# Altium schematic sheet RFE_Cellularv2.SchDoc
size A4
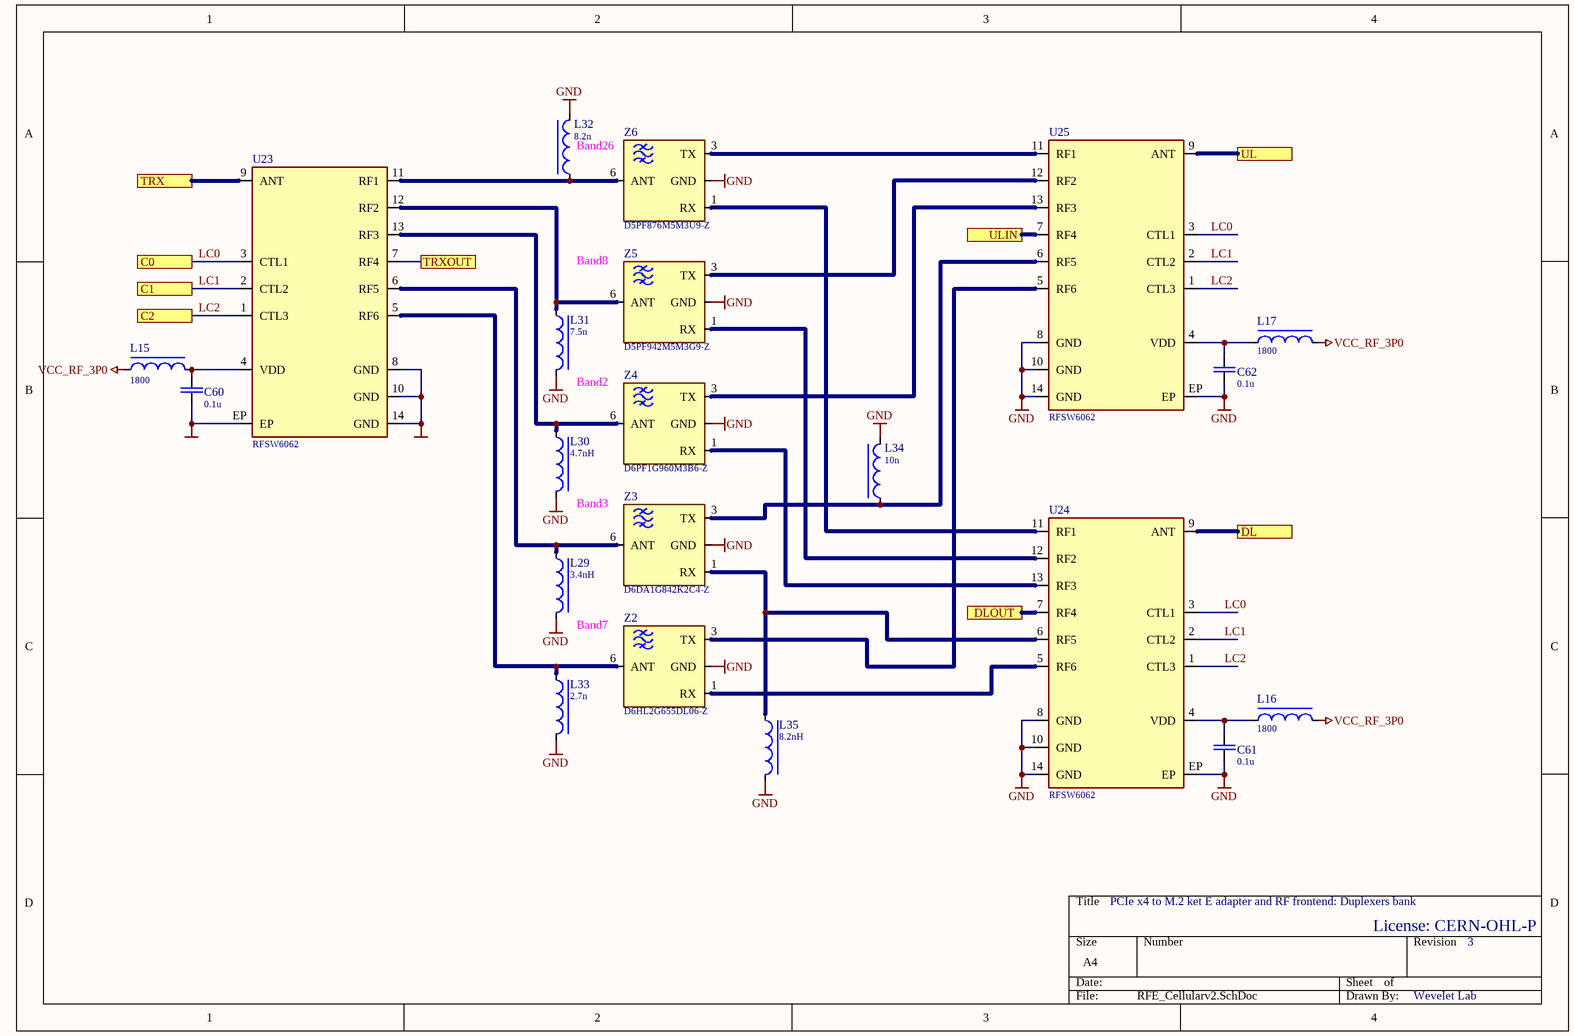
[diagram p0: RFE_Cellularv2.SchDoc]

## Parts
C60  value 0.1u  [CAPC100X50X55L25N]  (hidden comment: GRM155R71E104KE14D)
C61  value 0.1u  [CAPC100X50X55L25N]  (hidden comment: GRM155R71E104KE14D)
C62  value 0.1u  [CAPC100X50X55L25N]  (hidden comment: GRM155R71E104KE14D)
L15  value 1800  [INDC100X60X60L30N]  (hidden comment: BLM15HD182SN1D)
L16  value 1800  [INDC100X60X60L30N]  (hidden comment: BLM15HD182SN1D)
L17  value 1800  [INDC100X60X60L30N]  (hidden comment: BLM15HD182SN1D)
L29  value 3.4nH  [INDC60X30X35L15N]  (hidden comment: MLG0603P3N4BT000)
L30  value 4.7nH  [INDC60X30X35L15N]  (hidden comment: MLG0603P4N7HT000)
L31  value 7.5n  [INDC60X30X35L15N]  (hidden comment: MLG0603P7N5HTD25)
L32  value 8.2n  [INDC60X30X35L15N]  (hidden comment: MLG0603P8N2HTD25)
L33  value 2.7n  [INDC60X30X35L15N]  (hidden comment: MLG0603P2N7CTZ10)
L34  value 10n  [INDC60X30X35L15N]  (hidden comment: MLG0603P10NHTZ10)
L35  value 8.2nH  [INDC60X30X35L15N]  (hidden comment: MLG0603P8N2HT000)
U23  RFSW6062  [QFN15P40_200X200X60L21X18T100N]
U24  RFSW6062  [QFN15P40_200X200X60L21X18T100N]
U25  RFSW6062  [QFN15P40_200X200X60L21X18T100N]
Z2  value D6HL2G655DL06-Z  [TAIYO_YUDEN_SMD-9]  (hidden comment: D6HL2G655DL06)
Z3  D6DA1G842K2C4-Z  [TAIYO_YUDEN_SMD-8]
Z4  value D6PF1G960M3B6-Z  [TAIYO_YUDEN_SMD-9]  (hidden comment: D6PF1G960M3B6)
Z5  D5PF942M5M3G9-Z  [TAIYO_YUDEN_SMD-9]
Z6  D5PF876M5M3U9-Z  [TAIYO_YUDEN_SMD-9]

## Ports
C0, C1, C2, DL, DLOUT, TRX, TRXOUT, UL, ULIN

## Nets
GND: C60.2 C61.2 C62.2 L29.2 L30.2 L31.2 L32.2 L33.2 L34.2 L35.2 U23.8(GND) U23.10(GND) U23.14(GND) U23.EP U24.8(GND) U24.10(GND) U24.14(GND) U24.EP U25.8(GND) U25.10(GND) U25.14(GND) U25.EP Z2.GND Z3.GND Z4.GND Z5.GND Z6.GND
VCC_RF_3P0: L15.2 L16.2 L17.2
DL: U24.9(ANT) ; port DL
DLOUT: U24.7(RF4) ; port DLOUT
LC0: U23.3(CTL1) U24.3(CTL1) U25.3(CTL1) ; port C0
LC1: U23.2(CTL2) U24.2(CTL2) U25.2(CTL2) ; port C1
LC2: U23.1(CTL3) U24.1(CTL3) U25.1(CTL3) ; port C2
TRX: U23.9(ANT) ; port TRX
TRXOUT: U23.7(RF4) ; port TRXOUT
UL: U25.9(ANT) ; port UL
ULIN: U25.7(RF4) ; port ULIN
NetC60_1: C60.1 L15.1 U23.4(VDD)
NetC61_1: C61.1 L16.1 U24.4(VDD)
NetC62_1: C62.1 L17.1 U25.4(VDD)
NetL29_1: L29.1 U23.6(RF5) Z3.6(ANT)
NetL30_1: L30.1 U23.13(RF3) Z4.6(ANT)
NetL31_1: L31.1 U23.12(RF2) Z5.6(ANT)
NetL32_1: L32.1 U23.11(RF1) Z6.6(ANT)
NetL33_1: L33.1 U23.5(RF6) Z2.6(ANT)
NetL34_1: L34.1 U25.6(RF5) Z3.3(TX)
NetL35_1: L35.1 U24.6(RF5) Z3.1(RX)
NetU24_5: U24.5(RF6) Z2.1(RX)
NetU24_11: U24.11(RF1) Z6.1(RX)
NetU24_12: U24.12(RF2) Z5.1(RX)
NetU24_13: U24.13(RF3) Z4.1(RX)
NetU25_5: U25.5(RF6) Z2.3(TX)
NetU25_11: U25.11(RF1) Z6.3(TX)
NetU25_12: U25.12(RF2) Z5.3(TX)
NetU25_13: U25.13(RF3) Z4.3(TX)

## Notes on the sheet
- Band26
- (near Z5) Band8
- Band2
- Band3
- Band7
- PCIe x4 to M.2 ket E adapter and RF frontend: Duplexers bank
- License: CERN-OHL-P
- 3
- Wevelet Lab

## Library data of the parts
C60-C62 = GRM155R71E104KE14D: Capacitor, 0.1u, 25V, 10%, X7R, 0402; Manufacturer: Murata Electronics
L15-L17 = BLM15HD182SN1D: Ferrite bead, 1800Ohm@100MHz, 0,2A, 2.2Ohm, -55/+125, SMD0402; Manufacturer: Murata Electronics; Name: BLM15HD182SN1D
L29 = MLG0603P3N4BT000: Inductor, 3.4n, -55/+125, SMD0201; Manufacturer: TDK; Name: MLG0603P3N4BT000
L30 = MLG0603P4N7HT000: Inductor, 4.7n, -55/+125, SMD0201; Manufacturer: TDK; Name: MLG0603P4N7HT000
L31 = MLG0603P7N5HTD25: Inductor, 7.5n, -55/+125, SMD0201; Manufacturer: TDK; Name: MLG0603P7N5HTD25
L32 = MLG0603P8N2HTD25: Inductor, 8.2n, -55/+125, SMD0201; Manufacturer: TDK; Name: MLG0603P8N2HTD25
L33 = MLG0603P2N7CTZ10: Inductor, 2.7n, 0.5A, 200mOhm, -55/+125, SMD0201; Manufacturer: TDK; Name: MLG0603P2N7CTZ10
L34 = MLG0603P10NHTZ10: Inductor, 10n, -55/+125, SMD0201; Manufacturer: TDK; Name: MLG0603P10NHTZ10
L35 = MLG0603P8N2HT000: Inductor, 8.2n, -55/+125, SMD0201; Manufacturer: TDK; Name: MLG0603P8N2HT000
U23-U25 = RFSW6062: IC, Switch, SP6T, 5-6000MHz, -40/+85, / 14-QFN; Manufacturer: Qorvo; Value: RFSW6062
Z2 = D6HL2G655DL06: RF DUPLEXER, Band 7, -20/+85, SMD9; Manufacturer: TAIYO YUDEN
Z3 = D6DA1G842K2C4: RF DUPLEXER, Band 3, -20/+85, SMD8; Manufacturer: TAIYO YUDEN; Value: D6DA1G842K2C4-Z
Z4 = D6PF1G960M3B6: RF DUPLEXER, Band 2, -20/+85, SMD9; Manufacturer: TAIYO YUDEN
Z5 = D5PF942M5M3G9: RF DUPLEXER, Band 8, -20/+85, SMD9; Manufacturer: TAIYO YUDEN; Value: D5PF942M5M3G9-Z
Z6 = D5PF876M5M3U9: RF DUPLEXER, Band 26, -20/+85, SMD9; Manufacturer: TAIYO YUDEN; Value: D5PF876M5M3U9-Z